# EasyEDA schematic Firetruck - arduino uno shield - EasyEDA_export.json
TITLE: Firetruck Arduino UNO shield; REV: 1.0; Date: 2020-09-27; Sheet: 1/1; Drawn By: Lukas Kaplan; Company: lkaplan.cz
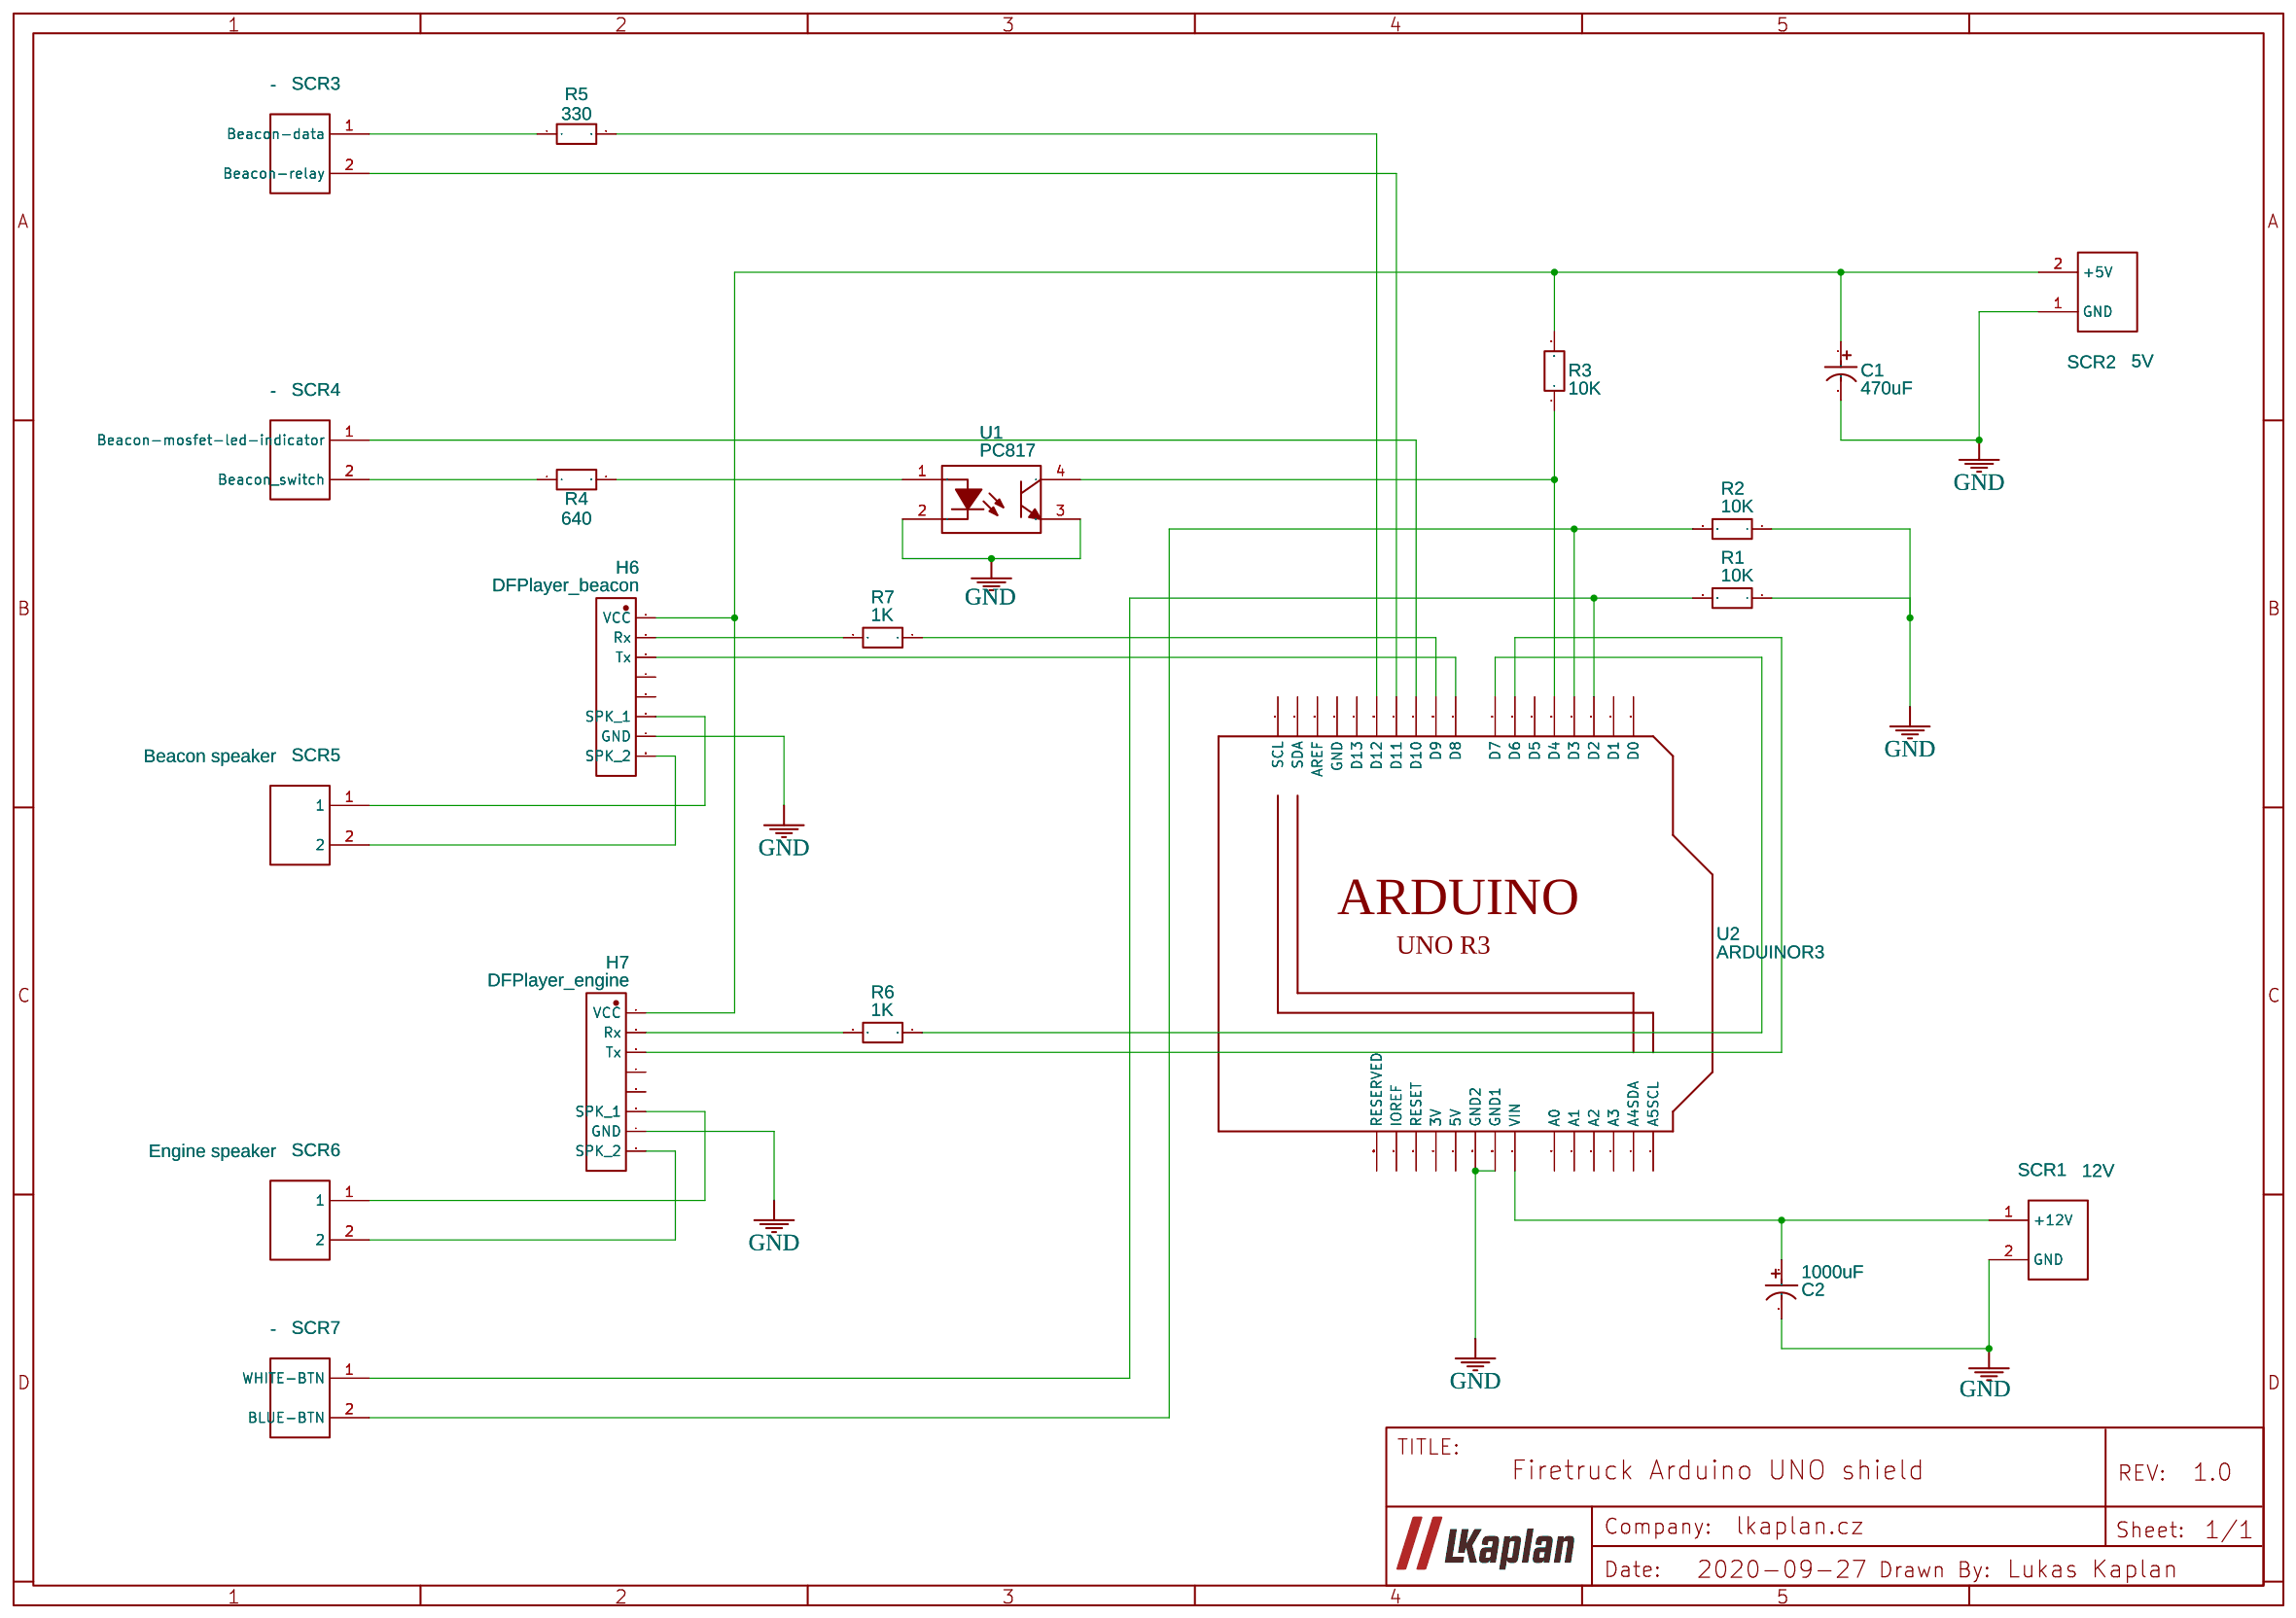
[diagram p0: schematic sheet]

## Parts
C1  470uF  [CAP-TH_BD8.0-P3.50-D1.0-FD]
C2  1000uF  [CAP-TH_BD10.0-P5.00-D1.0-FD]
H6  DFPlayer_beacon  [HDR-TH_8P-P2.54-V]
H7  DFPlayer_engine  [HDR-TH_8P-P2.54-V]
R1  10K  [RES-TH_BD2.7-L6.2-P10.20-D0.4]
R2  10K  [RES-TH_BD2.7-L6.2-P10.20-D0.4]
R3  10K  [RES-TH_BD2.7-L6.2-P10.20-D0.4]
R4  640  [RES-TH_BD2.7-L6.2-P10.20-D0.4]
R5  330  [RES-TH_BD2.7-L6.2-P10.20-D0.4]
R6  1K  [RES-TH_BD2.7-L6.2-P10.20-D0.4]
R7  1K  [RES-TH_BD2.7-L6.2-P10.20-D0.4]
SCR1  12V  [CONN-TH_2P-P5.08_1714984]
SCR2  5V  [CONN-TH_2P-P5.08_1714984]
SCR3  -  [CONN-TH_2P-P5.08_1714984]
SCR4  -  [CONN-TH_2P-P5.08_1714984]
SCR5  Beacon speaker  [CONN-TH_2P-P5.08_1714984]
SCR6  Engine speaker  [CONN-TH_2P-P5.08_1714984]
SCR7  -  [CONN-TH_2P-P5.08_1714984]
U1  PC817  [DIP-4_L6.4-W4.6-P2.54-LS7.6-BL]
U2  ARDUINOR3  [ARDUINOR3-BPLACE]

## Library data of the parts
C1 = 470uF 16V绿金 8*12: Supplier: LCSC; Manufacturer: ValuePro; Supplier Part: C43823
C2 = 1000uF 16V 10*16: Supplier: LCSC; Manufacturer: ValuePro; Supplier Part: C43831
H6 H7 = 215297-8: Supplier: LCSC; Supplier Part: C306180; Manufacturer: TE Connectivity; Contributor: LCSC
R1-R7 = MO1/4W-22K±5%-ST52: Supplier: LCSC; Supplier Part: C479388; Manufacturer: FlyWin; Contributor: LCSC
SCR1-SCR7 = MKDSN1.5/2-5.08: Supplier: LCSC; Manufacturer: Phoenix Contact; Supplier Part: C91153
U1 = PC817X3NSZW(C ): Supplier: LCSC; Manufacturer: SHARP; image: //image.lceda.cn/szlcsc/C4075.jpg; Supplier Part: C4075
U2 = ARDUINOR3: Contributor: Adafruit

## Nets
GND: C1.2 C2.2 H6.7(GND) H7.7(GND) R1.1 R2.1 SCR1.2(GND) SCR2.1(GND) U1.2 U1.3 U2.GND1 U2.GND2
Net-(C1-1): C1.1 H6.1(VCC) H7.1(VCC) R3.2 SCR2.2(+5V)
Net-(C2-1): C2.1 SCR1.1(+12V) U2.VIN
Net-(H6-2): H6.2(Rx) R7.2
Net-(H6-3): H6.3(Tx) U2.D8
Net-(H6-6): H6.6(SPK_1) SCR5.1
Net-(H6-8): H6.8(SPK_2) SCR5.2
Net-(H7-2): H7.2(Rx) R6.2
Net-(H7-3): H7.3(Tx) U2.D6
Net-(H7-6): H7.6(SPK_1) SCR6.1
Net-(H7-8): H7.8(SPK_2) SCR6.2
Net-(R1-2): R1.2 SCR7.1(WHITE-BTN) U2.D2
Net-(R2-2): R2.2 SCR7.2(BLUE-BTN) U2.D3
Net-(R3-1): R3.1 U1.4 U2.D4
Net-(R4-1): R4.1 SCR4.2(Beacon switch)
Net-(R4-2): R4.2 U1.1
Net-(R5-1): R5.1 SCR3.1(Beacon-data)
Net-(R5-2): R5.2 U2.D12
Net-(R6-1): R6.1 U2.D7
Net-(R7-1): R7.1 U2.D9
Net-(SCR3-2): SCR3.2(Beacon-relay) U2.D11
Net-(SCR4-1): SCR4.1(Beacon-mosfet-led-indicator) U2.D10

Not connected (* = marked no-connect by the designer): H6 4 5; H7 4 5; U2 3V 5V A0 A1 A2 A3 A4(A4SDA) A5(A5SCL) AREF D0 D1 D5 D13 GND IOREF RESERVED RESET SCL SDA
